# EAGLE design Zirkulation (EAGLE 9.6.2)
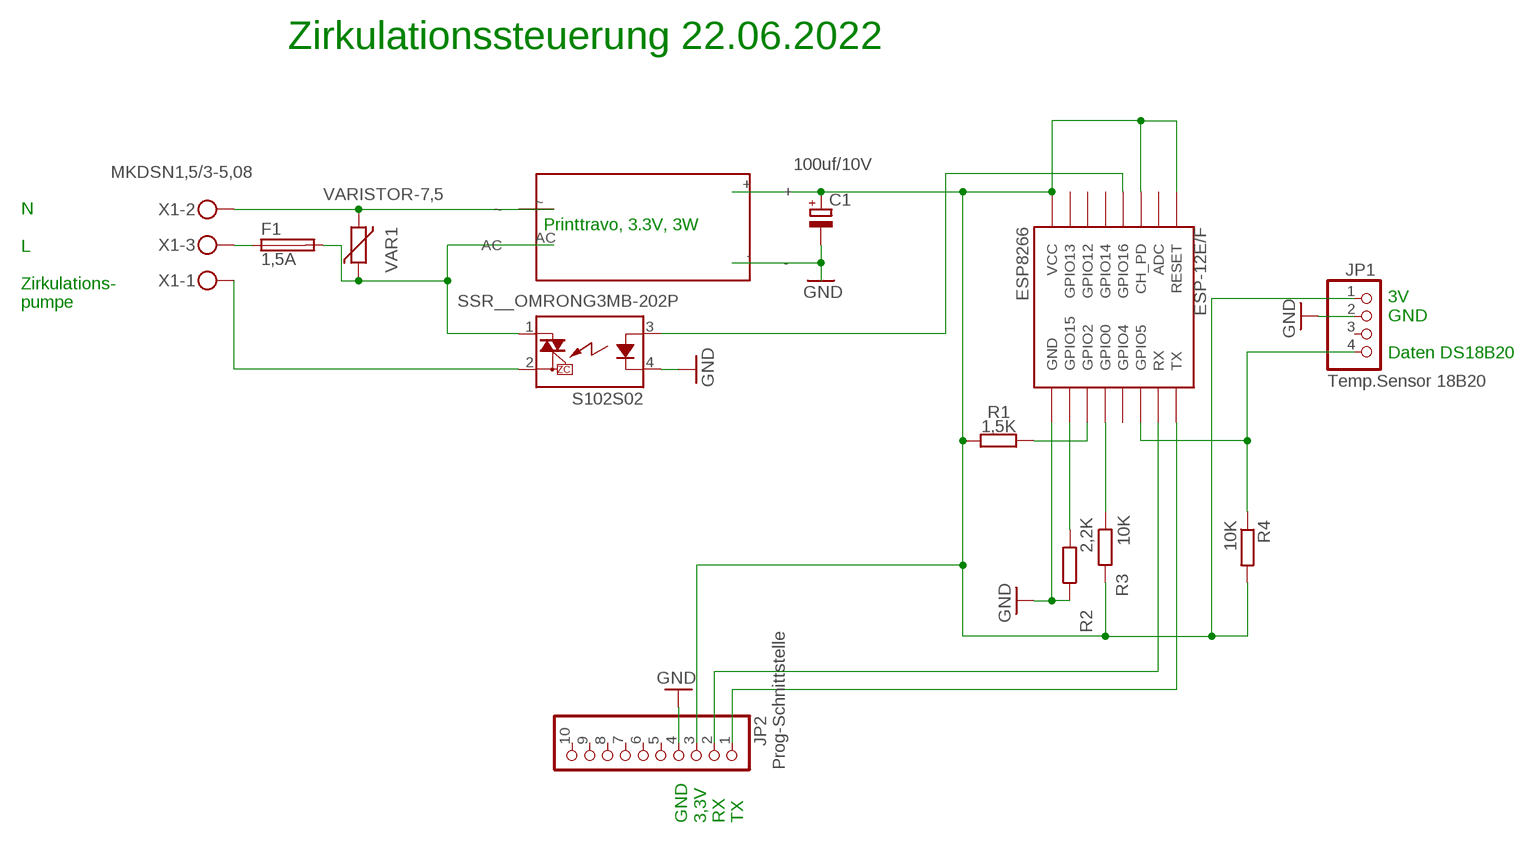
[diagram p0: schematic, sheet 1]

## Parts
C1  100uf/10V  CPOL-EUE2.5-7  [E2,5-7]
ESP-12E/F  ESP8266  ESP12SMD  [ESP12-SMD]
F1  1,5A  LITTLEFUSE  [LITTLEFUSE]
JP1  Temp.Sensor 18B20  PINHD-1X4  [1X04]
JP2  Prog-Schnittstelle  PINHD-1X10  [1X10]
PRINTTRAFO3.3V,_3W  PRINTTRAFO  [PRINTTRAFO]
R1  1,5K  R-EU_0204/7  [0204/7]
R2  2,2K  R-EU_0204/7  [0204/7]
R3  10K  R-EU_0204/7  [0204/7]
R4  10K  R-EU_0204/7  [0204/7]
SSR__OMRONG3MB-202P  S102S02  [S202S02]
VAR1  VARISTOR-7,5  [R-7,5]
X1  MKDSN1,5/3-5,08  [MKDSN1,5/3-5,08]

## Nets
3.3V: C1.+ ESP-12E/F.CH_PD ESP-12E/F.RESET ESP-12E/F.VCC JP1.1 JP2.3 PRINTTRAFO3.3V,_3W.+ R1.2 R3.2 R4.2
GND: C1.- ESP-12E/F.GND JP1.2 JP2.4 PRINTTRAFO3.3V,_3W.- R2.1 SSR__OMRONG3MB-202P.4(K)
GPIO0: ESP-12E/F.GPIO0 R3.1
GPIO2: ESP-12E/F.GPIO2 R1.1
GPIO5: ESP-12E/F.GPIO4(GPIO5) JP1.4 R4.1
GPIO15: ESP-12E/F.GPIO15 R2.2
GPIO16: ESP-12E/F.GPIO16 SSR__OMRONG3MB-202P.3(A)
L: F1.1 X1.3
L1 [230V]: SSR__OMRONG3MB-202P.2(DS2) X1.1
L_ [230V]: F1.2 PRINTTRAFO3.3V,_3W.AC SSR__OMRONG3MB-202P.1(DS1) VAR1.1
N [230V]: PRINTTRAFO3.3V,_3W.~ VAR1.2 X1.2
RX: ESP-12E/F.RXD0(RX) JP2.2
TX: ESP-12E/F.TXD0(TX) JP2.1
Unconnected: ESP-12E/F.ADC ESP-12E/F.GPIO5(GPIO4) ESP-12E/F.GPIO12 ESP-12E/F.GPIO13 ESP-12E/F.GPIO14 JP1.3 JP2.5 JP2.6 JP2.7 JP2.8 JP2.9 JP2.10

## Notes on the sheet
- Zirkulationssteuerung 22.06.2022
- N
  
  L
  
  Zirkulations-
  pumpe
- Printtravo, 3.3V, 3W
- 3V
  GND
   
  Daten DS18B20
- GND
  3,3V
  RX
  TX

## Library data of the parts
C1 = rcl:CPOL-EU: POLARIZED CAPACITOR, European symbol
ESP-12E/F = esp8266modules:ESP12: ESP8266 Wifi module 12
F1 = fuse:LITTLEFUSE: LITTLEFUSE Picofuse/slow Littlefuse; OC_FARNELL: unknown; OC_NEWARK: unknown
JP1 = pinhead:PINHD-1X4: PIN HEADER
JP2 = pinhead:PINHD-1X10: PIN HEADER
PRINTTRAFO3.3V,_3W = Uwes_lib:PRINTTRAFO
R1-R4 = rcl:R-EU_: RESISTOR, European symbol
SSR__OMRONG3MB-202P = relay:S*02S02: IT(rms) 8A, Zero Cross type SIP 4pin Triac output SSR Source: http://sharp-world.com/products/device/lineup/data/pdf/datasheet/s102s02_e.pdf; OC_FARNELL: unknown; OC_NEWARK: unknown
VAR1 = varistor:VARISTOR: VARISTOR
X1 = con-phoenix-508:MKDSN1,5/3-5,08: MKDSN 1,5/ 3-5,08 Printklemme Nennstrom: 13,5 A Nennspannung: 250 V Rastermaß: 5,08 mm Polzahl: 3 Anschlussart: Schraubanschluss Montage: Löten Anschlussrichtung Leiter/Platine: 0 ° Artikelnummer: 1729131 Source: http://eshop.phoenixcontact.com .. 1729131.pdf

## Net classes
0 default: width 0.305 mm
1 230V: width 1.016 mm, clearance 1.5 mm

## Board
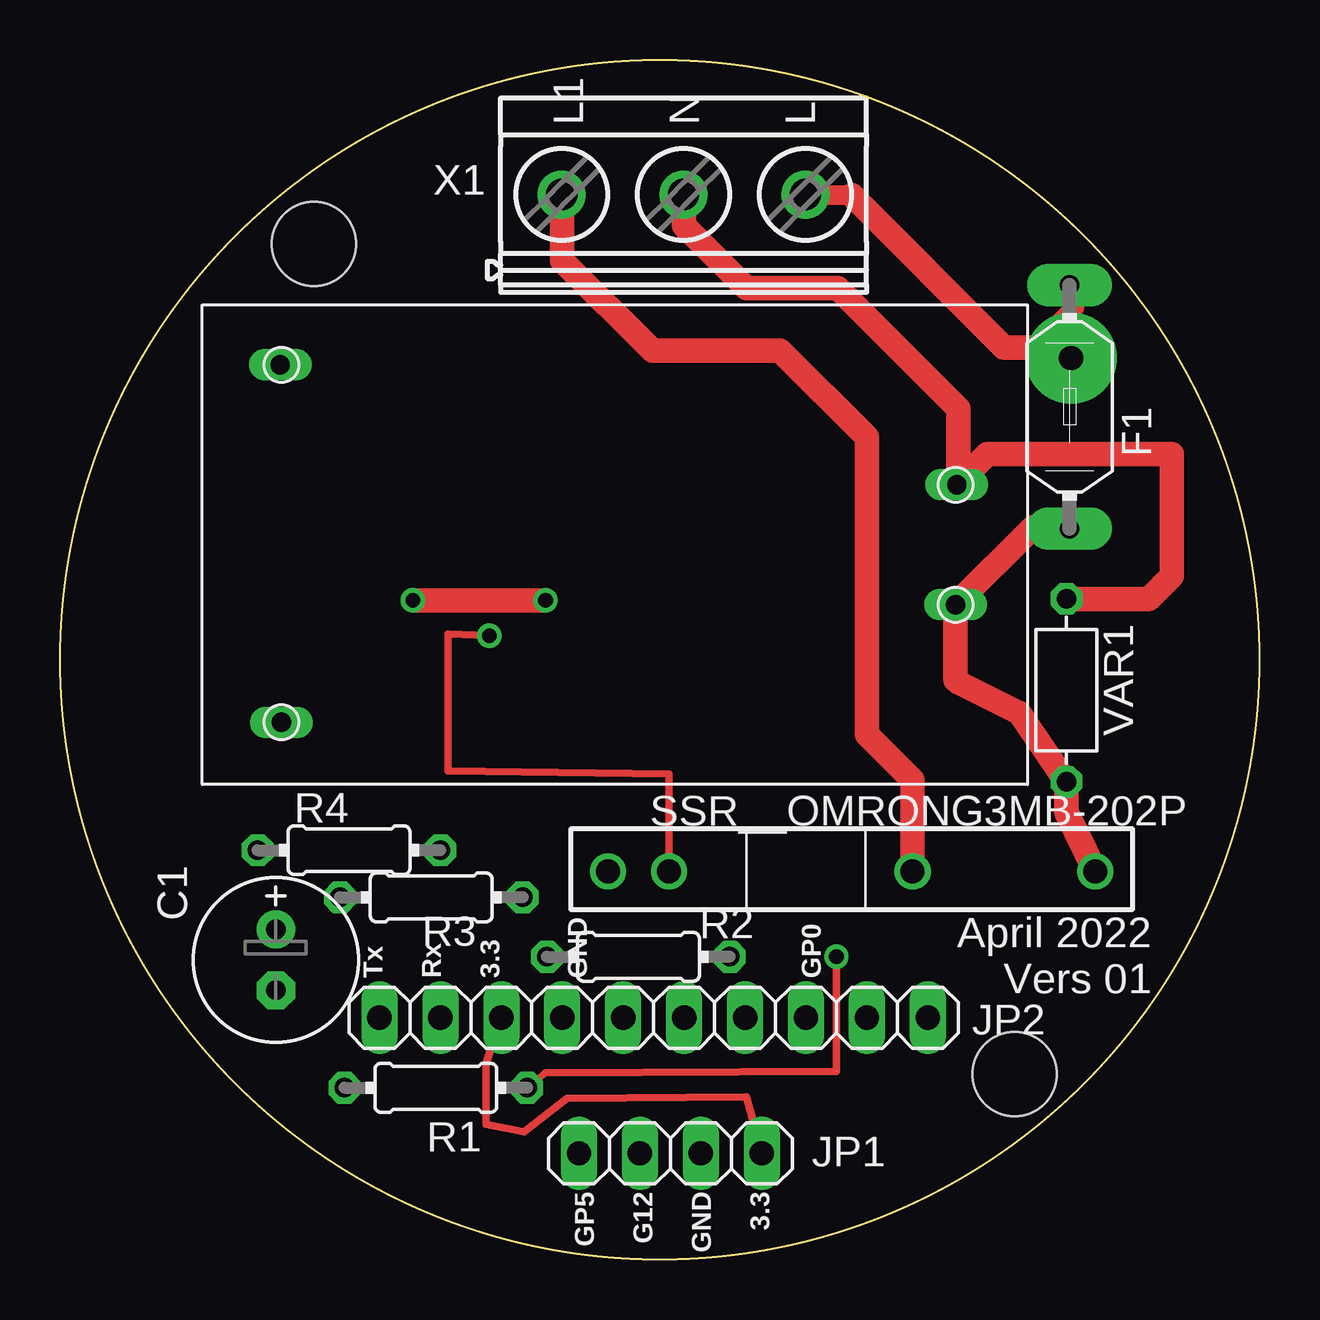
[diagram p1: board, top side]
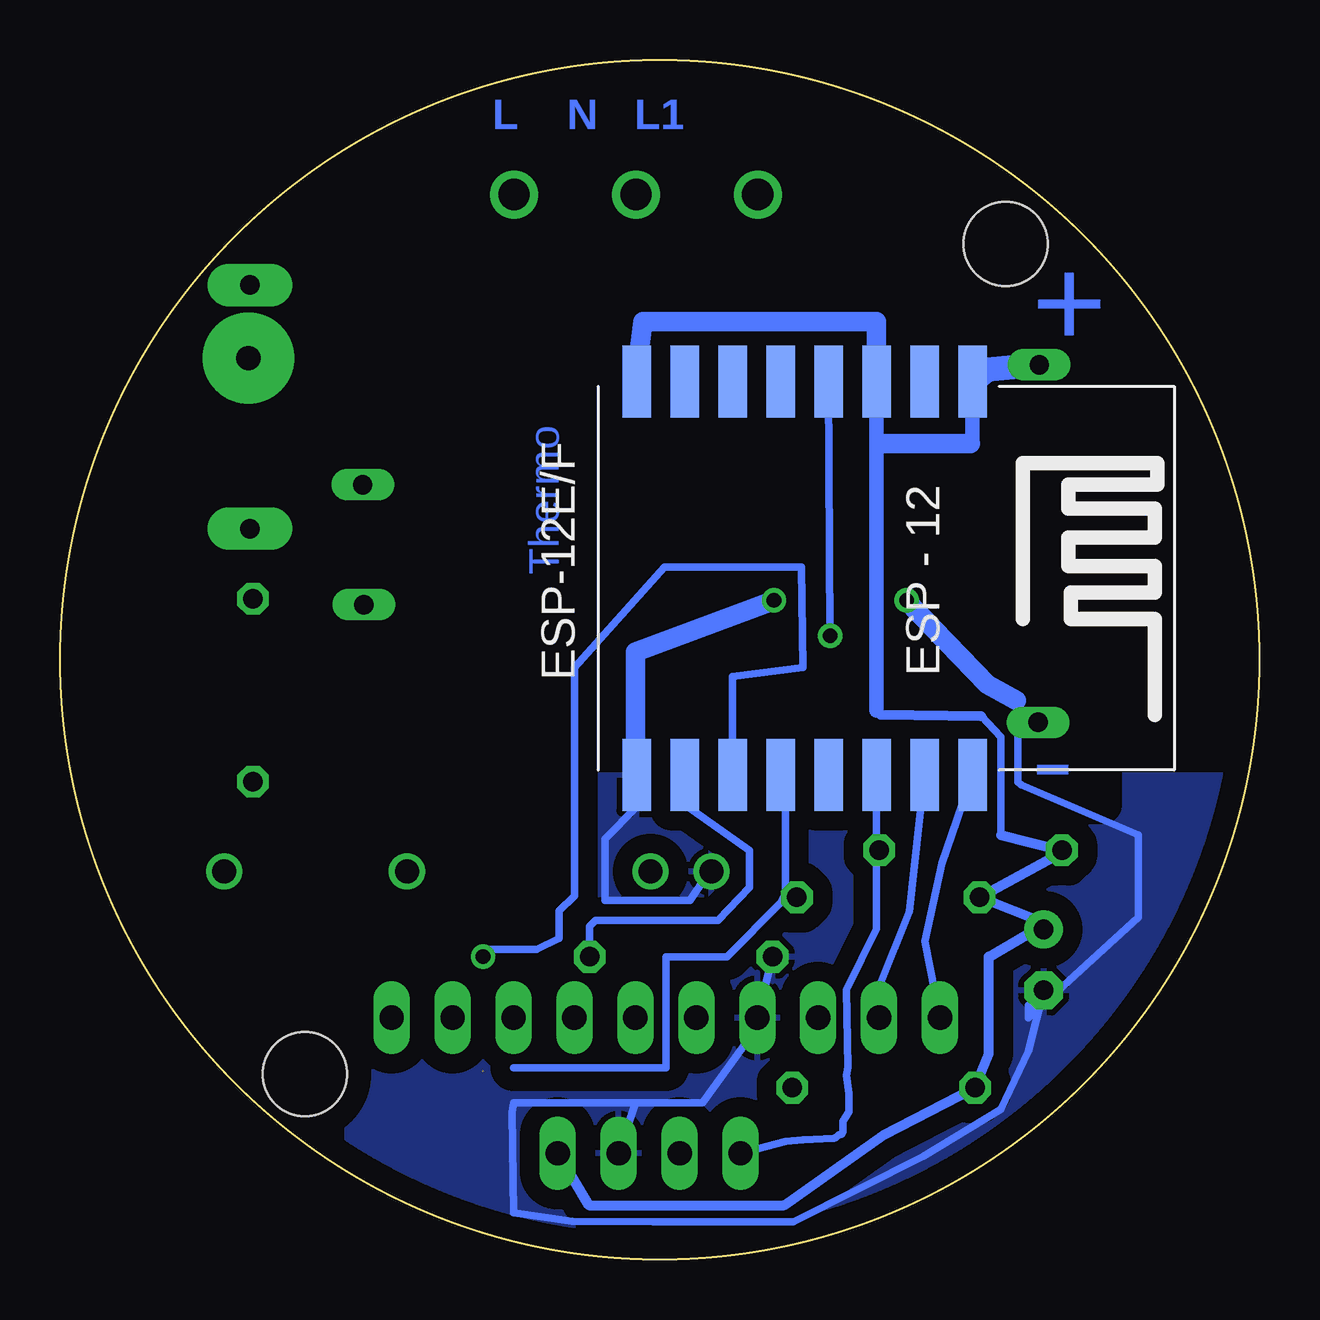
[diagram p2: board, bottom side, seen from below]

Size 50 x 50 mm. Coordinates in mm from the lower left corner, seen from the top.
Outline: circle at 25,25 radius 25
Copper layers (1*16): Top 0.035mm / dielectric 1.5mm / Bottom 0.035mm
Design rules "default": minimum track width 10mil, minimum drill 24mil, track to track 8mil, track to pad 8mil, pad to pad 8mil, via to via 8mil, smd to smd 8mil, copper to edge 40mil, drill to drill 8mil, minimum pad ring 10mil, minimum via ring 8mil, stop-mask expansion 4mil, vias tented up to drill 0mil, thermal gap 10mil
Holes 3.5 mm at 10.59,42.34 39.8,7.73

### Footprints (pad centres in the part's own frame; a part is rotated, then mirrored left to right if it is on the bottom)
E2,5-7 = drill 0.813 pad 1.6: + -1.27,0 | drill 0.813 pad 1.6 octagon: - 1.27,0
ESP12-SMD = smd 3 x 1.2: ADC -8.3,3.8; CH_PD -8.3,1.8; GND 8.1,-8.2; GPIO0 8.1,-2.2; GPIO2 8.1,-4.2; GPIO4 8.1,1.8; GPIO5 8.1,-0.2; GPIO12 -8.3,-4.2; GPIO13 -8.3,-6.2; GPIO14 -8.3,-2.2; GPIO15 8.1,-6.2; GPIO16 -8.3,-0.2; RESET -8.3,5.8; RXD0 8.1,3.8; TXD0 8.1,5.8; VCC -8.3,-8.2
LITTLEFUSE = drill 0.813 pad 1.778 long: 1 -5.08,0; 2 5.08,0
1X04 = drill 1.016 long: 1 -3.81,0; 2 -1.27,0; 3 1.27,0; 4 3.81,0
1X10 = drill 1.016 long: 1 -11.43,0; 2 -8.89,0; 3 -6.35,0; 4 -3.81,0; 5 -1.27,0; 6 1.27,0; 7 3.81,0; 8 6.35,0; 9 8.89,0; 10 11.43,0
PRINTTRAFO = drill 0.8 long: + -1.15,17.5; - -1.1,2.6; AC 27,7.5; ~ 27.05,12.5
0204/7 = drill 0.813 octagon: 1 -3.81,0; 2 3.81,0
S202S02 = drill 1: 1 -7.62,0; 2 0,0; 3 10.16,0; 4 12.7,0
R-7,5 = drill 0.813 octagon: 1 -3.81,0; 2 3.81,0
MKDSN1,5/3-5,08 = drill 1.3 pad 2: 1 -7.641,0.025; 2 -2.561,0.025; 3 2.519,0.025

### Placement (x,y rotation side)
C1  9,12.49 270 top
ESP-12E/F  17.76,28.3 270 bottom
F1  42.08,35.54 270 top
JP1  25.44,4.43 180 top
JP2  24.75,10.08 0 top
PRINTTRAFO3.3V,_3W  10.33,19.79 0 top
R1  15.67,7.16 180 top
R2  24.11,12.62 0 top
R3  15.48,15.09 180 top
R4  12.05,17.06 180 top
SSR__OMRONG3MB-202P  35.54,16.17 180 top
VAR1  41.95,23.73 90 top
X1  28.56,44.37 0 top

### Tracks (layer width: path | path; a pad name or v marks a point on that pad's centre or on a via)
3.3V
  Top 0.305: JP1.1 28.62,6.78 21.13,6.71 19.35,5.32 17.76,5.63 17.76,8.17 JP2.3
  Bottom 0.305: 11.6,22.65 10.78,21.77 10.78,17.7
  Bottom 0.406: 15.96,33.68 15.86,34.02 | 12.05,34.02 11.96,34.12 | 11.6,22.65 15.8,22.72 15.96,22.88 | 10.78,17.7 R4.2 8.17,17 R3.2 8.93,14.01 9.25,14.01 C1.+ 9.12,13.89 11.28,12.62 11.28,8.57 R1.2 15.67,5.19 19.81,2.27 27.96,2.27 JP1.1 | 25.57,39.1 25.7,39.1 | 26.02,36.66 ESP-12E/F.VCC
  Bottom 0.61: ESP-12E/F.CH_PD 15.96,33.68 15.96,22.88 | 11.96,34.12 ESP-12E/F.RESET
  Bottom 0.813: ESP-12E/F.CH_PD 15.96,39.1 25.57,39.1 | 15.86,34.02 12.05,34.02 | 25.7,39.1 26.02,36.66
  Bottom 1.016: ESP-12E/F.RESET 11.34,37.09 PRINTTRAFO3.3V,_3W.+
GND  (via drill 0.61)
  Top 1.016: v20.24,27.48 v14.71,27.48
  Bottom 0.305: 26.02,20.82 25.96,20.67 ESP-12E/F.GND 25.96,18.86 27.29,17.54 27.29,14.97 23.73,14.97 23.09,15.92 SSR__OMRONG3MB-202P.4 | 10.14,23.3 10.07,23.18 10.07,22.54 | 10.07,22.54 PRINTTRAFO3.3V,_3W.- | 9.63,10.08 C1.- 9.63,8.68 10.78,6.27 14.02,4.3 19.43,1.57 25.27,1.57 28.66,1.6 31.1,1.95 31.16,6.14 31.1,6.52 26.02,6.52 | 9.63,10.08 9.63,10.59 | 9.63,10.08 5.06,14.27 5.06,17.7 9.93,19.77 10.07,19.91 10.07,22.54 | R2.1 JP2.4 21.57,8.81 23.22,6.52 26.02,6.52 | JP1.2 26.02,6.52
  Bottom 0.813: 26.02,20.82 26.02,25.32 v20.24,27.48 | v14.71,27.48 11.34,23.98 10.14,23.3
  pour Bottom (isolate 0.813): -2.56,20.24 30.46,20.24 31.1,19.6 31.1,15.79 33.64,13.25 36.18,13.25 38.08,11.35 38.08,-1.99 -0.65,-1.99 -2.56,-0.08 -1.29,18.97
GPIO0
  Bottom 0.305: 19.77,15.28 19.96,14.86 22.21,12.62 24.75,12.62 24.75,7.98 31.1,7.98 | 19.77,15.28 19.77,19.48 ESP-12E/F.GPIO0 | R3.1 19.77,15.28
GPIO2  (via drill 0.61)  (1 unrouted)
  Top 0.305: R1.1 20.24,7.79 32.37,7.85 | v32.37,12.62 32.37,7.85
  Bottom 0.305: ESP-12E/F.GPIO2 21.96,24.29 19.03,24.68 19.09,28.87 24.81,28.87 28.56,24.68 28.56,15.16 29.19,14.52 29.19,13.38 30.13,12.94 32.05,12.94 v32.37,12.62
GPIO5
  Bottom 0.305: ESP-12E/F.GPIO4 15.96,17.06 | 15.96,17.06 15.96,13.78 17.23,11.25 17.16,8.02 17.21,7.69 17.11,6.92 17.11,6.16 17.36,5.76 17.36,5.32 17.43,5.21 17.52,5.2 17.67,5.07 17.74,5.06 19.03,5 19.73,4.93 JP1.4 | R4.1 15.96,17.06
GPIO15
  Bottom 0.305: 23.96,20.77 ESP-12E/F.GPIO15 24.11,21.25 24.11,19.08 21.25,17.06 21.25,15.51 22.56,14.14 27.67,14.14 27.92,13.89 R2.2 27.92,12.43
GPIO16  (via drill 0.61)
  Top 0.305: v17.9,26.01 16.17,26.08 16.17,20.36 25.38,20.24 SSR__OMRONG3MB-202P.3
  Bottom 0.305: v17.9,26.01 ESP-12E/F.GPIO16
L
  Top 0.813: X1.3 31.1,44.37 33,44.37 | 40.62,38.02 42.27,39.67 F1.1
  Top 1.016: 33,44.37 39.35,38.02 40.62,38.02
L1
  Top 1.016: SSR__OMRONG3MB-202P.2 35.54,19.98 33.64,21.89 33.64,34.27 30.02,37.89 24.69,37.89 20.94,41.64 20.94,44.37 X1.1
L_
  Top 1.016: F1.2 40.56,30.52 PRINTTRAFO3.3V,_3W.AC 37.33,24.16 37.45,24.05 39.99,22.78 41.89,19.98 VAR1.1 41.95,18.65 SSR__OMRONG3MB-202P.1
N
  Top 1.016: X1.2 26.02,44.37 26.02,43.1 28.62,40.49 32.43,40.49 37.45,35.48 37.45,32.36 PRINTTRAFO3.3V,_3W.~ 38.66,33.57 46.34,33.57 46.34,28.49 45.38,27.54 VAR1.2
N$1  (via drill 1.02 pad 3.81)
  other vias: 42.15,37.57
RX
  Bottom 0.305: ESP-12E/F.RXD0 14.6,14.51 15.86,11.35 JP2.2
TX
  Bottom 0.305: ESP-12E/F.TXD0 13.23,16.51 13.95,13.25 JP2.1

### Text on the board
Bottom: L N L1 | + | Thermo | -
tNames: L1 / / N / / L | Tx / / Rx / / 3.3 / / / GND / / / / / / / / GP0 | April 2022 / Vers 01 | GP5 / / G12 / / GND / / 3.3